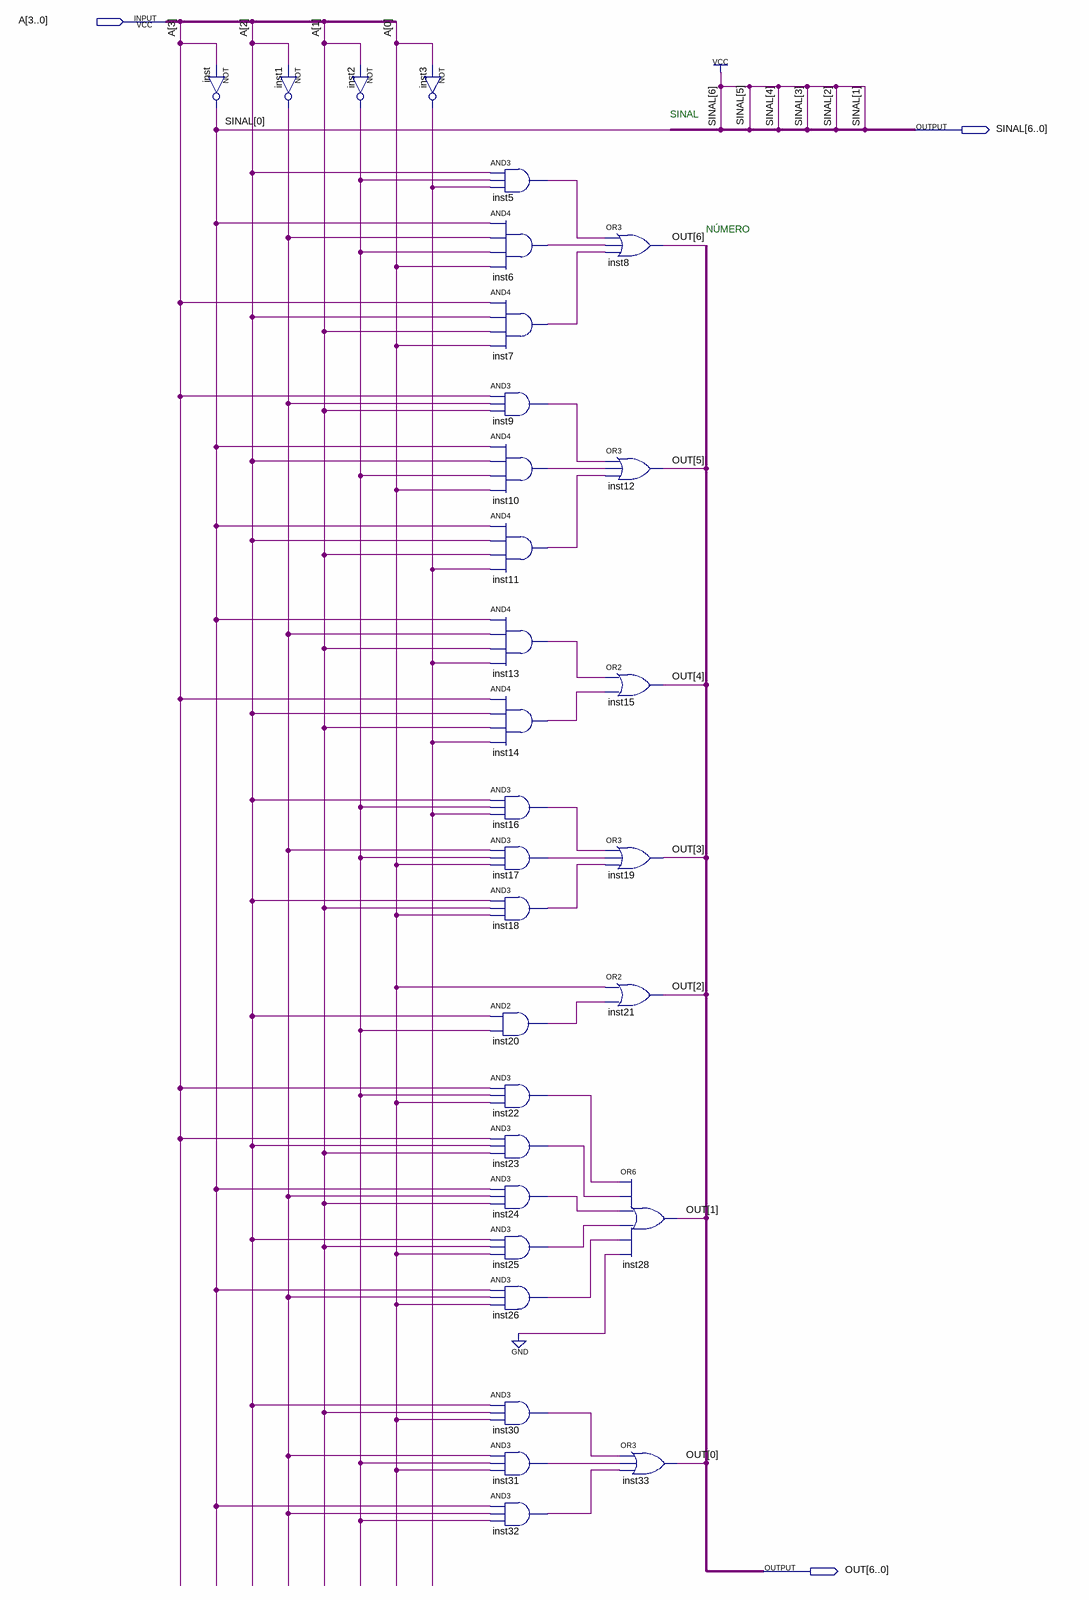
[diagram p0: schematic sheet]
// Quartus schematic Decodificador_Func.bdf as structural Verilog: 31 symbols, 3 pins
module Decodificador_Func (
  input  [3:0] A,
  output [6:0] SINAL,
  output [6:0] OUT
);

  wire inst1_out, inst2_out, inst3_out, inst5_out, inst6_out, inst7_out, inst9_out, inst10_out, inst11_out,
       inst13_out, inst14_out, inst16_out, inst17_out, inst18_out, inst20_out, inst22_out, inst23_out,
       inst24_out, inst25_out, inst26_out, inst30_out, inst31_out, inst32_out;

  not inst (SINAL[0], A[3]);
  not inst1 (inst1_out, A[2]);
  not inst2 (inst2_out, A[1]);
  not inst3 (inst3_out, A[0]);
  and inst5 (inst5_out, A[2], inst2_out, inst3_out);
  and inst6 (inst6_out, SINAL[0], inst1_out, inst2_out, A[0]);
  and inst7 (inst7_out, A[3], A[2], A[1], A[0]);
  and inst9 (inst9_out, A[3], inst1_out, A[1]);
  and inst10 (inst10_out, SINAL[0], A[2], inst2_out, A[0]);
  and inst11 (inst11_out, SINAL[0], A[2], A[1], inst3_out);
  and inst13 (inst13_out, SINAL[0], inst1_out, A[1], inst3_out);
  and inst14 (inst14_out, A[3], A[2], A[1], inst3_out);
  and inst16 (inst16_out, A[2], inst2_out, inst3_out);
  and inst17 (inst17_out, inst1_out, inst2_out, A[0]);
  and inst18 (inst18_out, A[2], A[1], A[0]);
  and inst20 (inst20_out, A[2], inst2_out);
  and inst22 (inst22_out, A[3], inst2_out, A[0]);
  and inst23 (inst23_out, A[3], A[2], A[1]);
  and inst24 (inst24_out, SINAL[0], inst1_out, A[1]);
  and inst25 (inst25_out, A[2], A[1], A[0]);
  and inst26 (inst26_out, SINAL[0], inst1_out, A[0]);
  and inst30 (inst30_out, A[2], A[1], A[0]);
  and inst31 (inst31_out, inst1_out, inst2_out, A[0]);
  and inst32 (inst32_out, SINAL[0], inst1_out, inst2_out);
  or inst8 (OUT[6], inst5_out, inst6_out, inst7_out);
  or inst12 (OUT[5], inst9_out, inst10_out, inst11_out);
  or inst15 (OUT[4], inst13_out, inst14_out);
  or inst19 (OUT[3], inst16_out, inst17_out, inst18_out);
  or inst21 (OUT[2], A[0], inst20_out);
  or inst28 (OUT[1], inst22_out, inst23_out, inst24_out, inst25_out, inst26_out, 1'b0);
  or inst33 (OUT[0], inst30_out, inst31_out, inst32_out);

  assign SINAL[6:1] = {6{1'b1}};

  // Notes on the sheet:
  //   SINAL
  //   NÚMERO
endmodule
